# EAGLE schematic Audio_Test_Board (EAGLE 9.6.2)

## Sheet 1 of 3
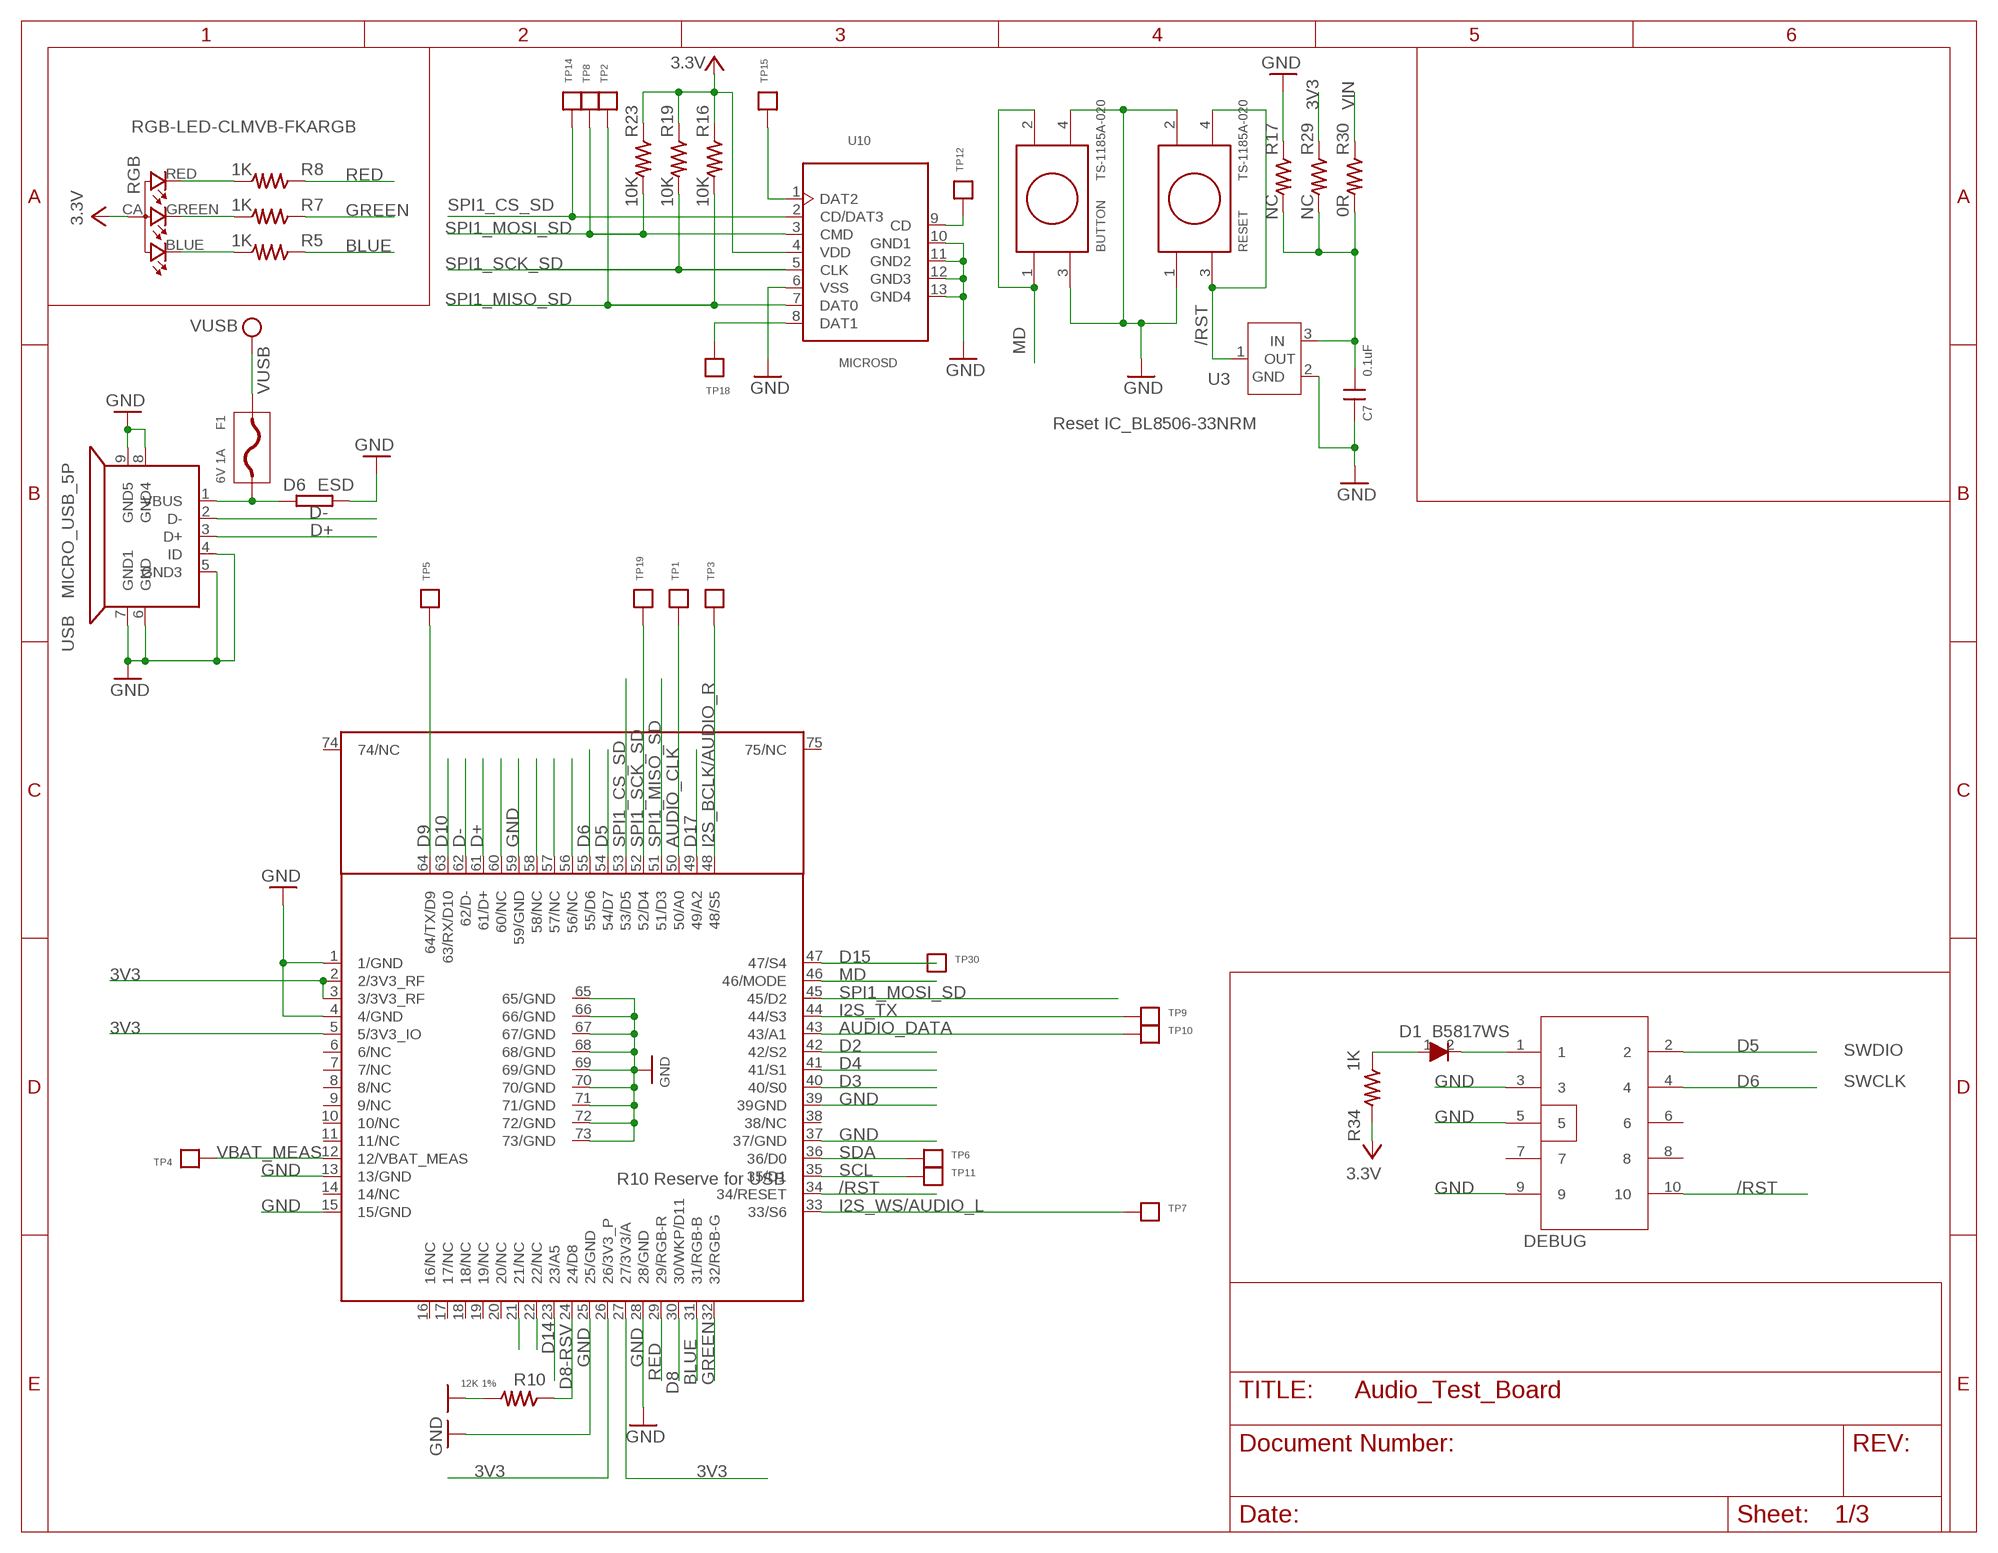
[diagram p0: schematic, sheet 1]

### Parts
BUTTON  TS-1185A-020  [TS-1185A-020]
C7  0.1uF  CAP0402  [C-0402]
D1  B5817WS  DIODESOD323  [SOD-323]
D6  ESD  RES0402S  [R-0402S]
DEBUG  CON5X2  [CON5X2_1.27]
F1  6V 1A  FUSE  [F0805]
P2  TRON  [TRON]
R5  1K  RES0402S  [R-0402S]
R7  1K  RES0402S  [R-0402S]
R8  1K  RES0402S  [R-0402S]
R10  12K 1%  RES0402S  [R-0402S]
R16  10K  RES0402S  [R-0402S]
R17  NC  RES0402S  [R-0402S]
R19  10K  RES0402S  [R-0402S]
R23  10K  RES0402S  [R-0402S]
R29  NC  RES0402S  [R-0402S]
R30  0R  RES0402S  [R-0402S]
R34  1K  RES0402S  [R-0402S]
RESET  TS-1185A-020  [TS-1185A-020]
RGB  RGB-LED-CLMVB-FKARGB  [PLCC4-2MM-RGB]
TP1  TP  [TP0.7MM]
TP2  TP  [TP0.7MM]
TP3  TP  [TP0.7MM]
TP4  TP  [TP0.7MM]
TP5  TP  [TP0.7MM]
TP6  TP  [TP0.7MM]
TP7  TP  [TP0.7MM]
TP8  TP  [TP0.7MM]
TP9  TP  [TP0.7MM]
TP10  TP  [TP0.7MM]
TP11  TP  [TP0.7MM]
TP12  TP  [TP0.7MM]
TP14  TP  [TP0.7MM]
TP15  TP  [TP0.7MM]
TP18  TP  [TP0.7MM]
TP19  TP  [TP0.7MM]
TP30  TP  [TP0.7MM]
U3  Reset IC_BL8506-33NRM  PARTICLE-SZ_BL8506  [PARTICLE-SZ_SOT-23]
U10  MICROSD  [MICROSD]
USB  MICRO_USB_5P  MICRO_USBMICRO_USB  [MICRO_USB]

### Nets
3V3 [power]: P2.2(2/3V3_RF) P2.3(3/3V3_RF) P2.5(5/3V3_IO) P2.26(26/3V3_P) P2.27(27/3V3/A) R16.1 R19.1 R23.1 R29.1 R34.2 RGB.CA U10.4(VDD) ; supply symbol labelled 3.3V ; also sheet 2,3
/RST: DEBUG.10 P2.34(34/RESET) RESET.3 RESET.4 U3.1(OUT)
AUDIO_CLK: P2.50(50/A0) TP1.P$1 ; also sheet 3
AUDIO_DATA: P2.43(43/A1) TP10.P$1 ; also sheet 3
BLUE: P2.31(31/RGB-B) R5.1
D2: P2.42(42/S2)
D3: P2.40(40/S0)
D4: P2.41(41/S1)
D5: DEBUG.2 P2.54(54/D7)
D6: DEBUG.4 P2.55(55/D6)
D8: P2.30(30/WKP/D11)
D8-RSV: P2.24(24/D8) R10.1
D9: P2.64(64/TX/D9) TP5.P$1
D10: P2.63(63/RX/D10)
D14: P2.23(23/A5)
D15: P2.47(47/S4) TP30.P$1
D17: P2.49(49/A2)
D+ [DIIFF]: P2.61(61/D+) USB.3(D+)
D- [DIIFF]: P2.62(62/D-) USB.2(D-)
GND [power]: BUTTON.3 BUTTON.4 C7.2 D6.1 DEBUG.3 DEBUG.5 DEBUG.9 P2.1(1/GND) P2.4(4/GND) P2.13(13/GND) P2.15(15/GND) P2.25(25/GND) P2.28(28/GND) P2.37(37/GND) P2.39(39GND) P2.59(59/GND) P2.65(65/GND) P2.66(66/GND) P2.67(67/GND) P2.68(68/GND) P2.69(69/GND) P2.70(70/GND) P2.71(71/GND) P2.72(72/GND) P2.73(73/GND) R10.2 R17.1 RESET.1 RESET.2 U3.2(GND) U10.6(VSS) U10.10(GND1) U10.11(GND2) U10.12(GND3) U10.13(GND4) USB.4(ID) USB.5(GND3) USB.6(GND) USB.7(GND1) USB.8(GND4) USB.9(GND5) ; also sheet 2,3
GREEN: P2.32(32/RGB-G) R7.1
I2S_BCLK/AUDIO_R: P2.48(48/S5) TP3.P$1 ; also sheet 3
I2S_TX: P2.44(44/S3) TP9.P$1 ; also sheet 3
I2S_WS/AUDIO_L: P2.33(33/S6) TP7.P$1 ; also sheet 3
MD: BUTTON.1 BUTTON.2 P2.46(46/MODE)
N$2: D1.1 R34.1
N$3: P2.21(21/NC)
N$4: P2.22(22/NC)
N$6: D1.2 DEBUG.1
N$9: TP12.P$1 U10.9(CD)
N$10: P2.56(56/NC)
N$18: D6.2 F1.P$1 USB.1(VBUS)
N$23: R8.2 RGB.RED
N$25: P2.57(57/NC)
N$26: R5.2 RGB.BLUE
N$27: R7.2 RGB.GREEN
N$33: P2.58(58/NC)
N$36: P2.60(60/NC)
N$38: TP15.P$1 U10.1(DAT2)
N$43: TP18.P$1 U10.8(DAT1)
N$49: C7.1 R17.2 R29.2 R30.2 U3.3(IN)
RED: P2.29(29/RGB-R) R8.1
SCL: P2.35(35/D1) TP11.P$1
SDA: P2.36(36/D0) TP6.P$1
SPI1_CS_SD: P2.53(53/D5) TP14.P$1 U10.2(CD/DAT3)
SPI1_MISO_SD: P2.51(51/D3) R16.2 TP2.P$1 U10.7(DAT0)
SPI1_MOSI_SD: P2.45(45/D2) R23.2 TP8.P$1 U10.3(CMD)
SPI1_SCK_SD: P2.52(52/D4) R19.2 TP19.P$1 U10.5(CLK)
VBAT_MEAS: P2.12(12/VBAT_MEAS) TP4.P$1
VIN [power]: R30.1 ; also sheet 2
VUSB [power]: F1.P$2 ; also sheet 2
Unconnected: DEBUG.6 DEBUG.7 DEBUG.8 P2.6(6/NC) P2.7(7/NC) P2.8(8/NC) P2.9(9/NC) P2.10(10/NC) P2.11(11/NC) P2.14(14/NC) P2.16(16/NC) P2.17(17/NC) P2.18(18/NC) P2.19(19/NC) P2.20(20/NC) P2.38(38/NC) P2.74(74/NC) P2.75(75/NC)

### Notes on the sheet
- SWDIO
- SWCLK
- R10 Reserve for USB

## Sheet 2 of 3
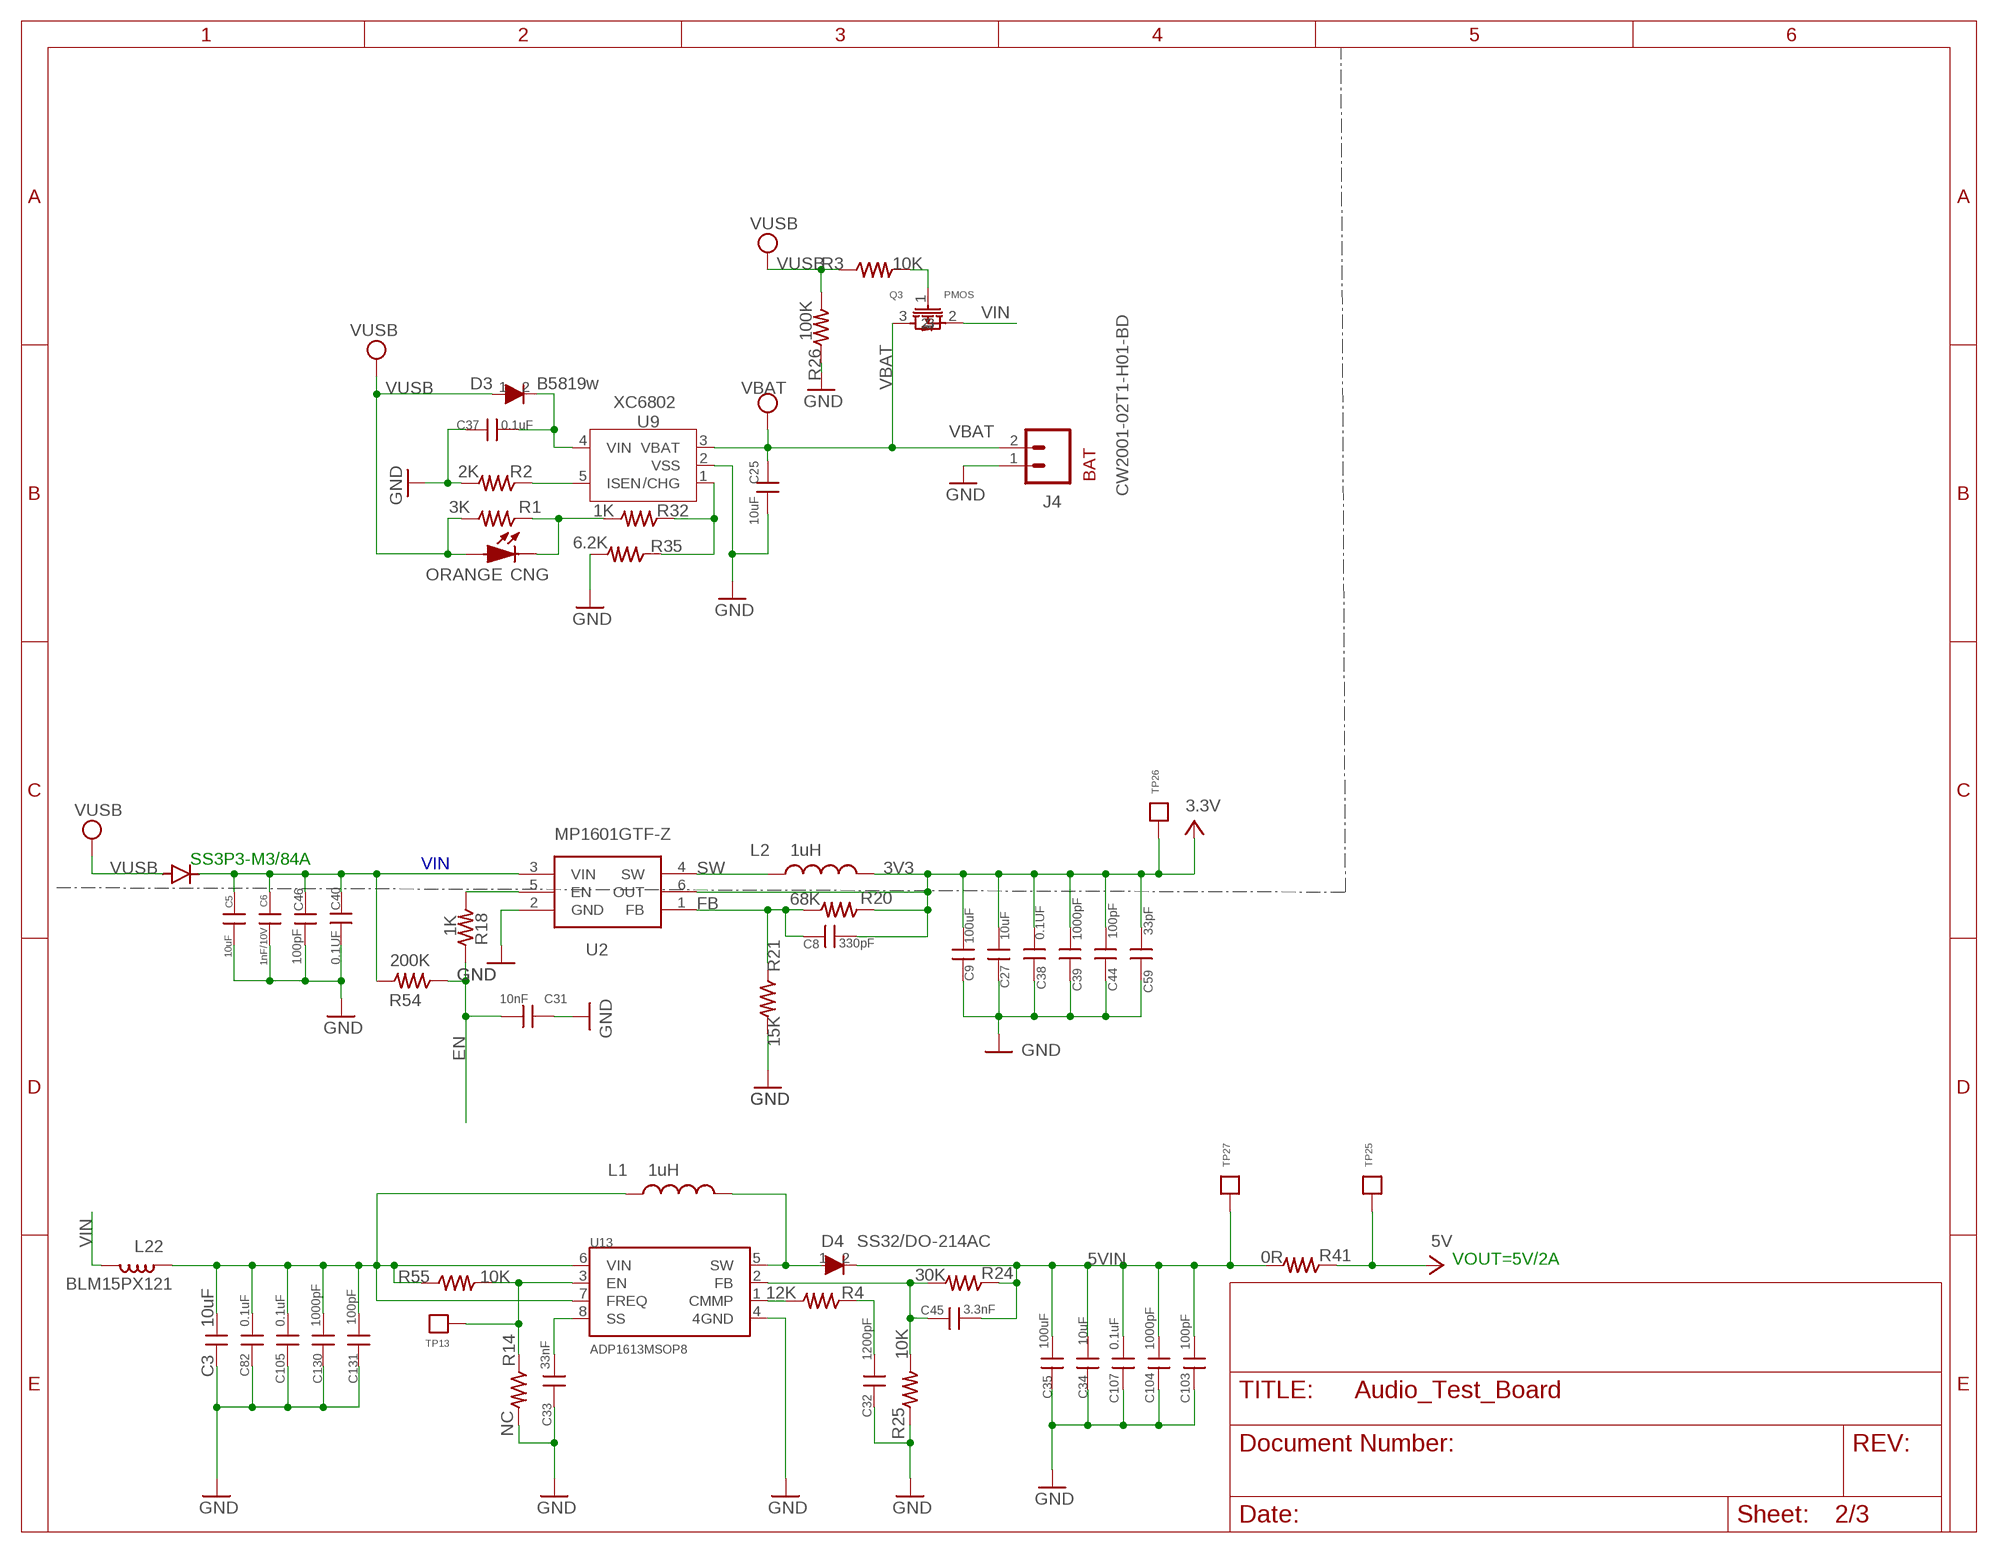
[diagram p1: schematic, sheet 2]

### Parts
C3  10uF  CAPC0603  [C0603]
C5  10uF  CAPC0603  [C0603]
C6  1nF/10V  CAP0402  [C-0402]
C8  330pF  CAP0402A  [C0402]
C9  100uF  CAPC1206  [C1206]
C25  10uF  CAPC0805  [C0805]
C27  10uF  CAPC0603  [C0603]
C31  10nF  CAP0402  [C-0402]
C32  1200pF  CAP0402  [C-0402]
C33  33nF  CAP0402  [C-0402]
C34  10uF  CAPC0603  [C0603]
C35  100uF  CAPC1206  [C1206]
C37  0.1uF  CAP0402  [C-0402]
C38  0.1UF  CAP0402  [C-0402]
C39  1000pF  CAP0402  [C-0402]
C40  0.1UF  CAP0402  [C-0402]
C44  100pF  CAP0402  [C-0402]
C45  3.3nF  CAP0402A  [C0402]
C46  100pF  CAP0402  [C-0402]
C59  33pF  CAP0402  [C-0402]
C82  0.1uF  CAP0402A  [C0402]
C103  100pF  CAP0402  [C-0402]
C104  1000pF  CAP0402  [C-0402]
C105  0.1uF  CAP0402A  [C0402]
C107  0.1uF  CAP0402  [C-0402]
C130  1000pF  CAP0402A  [C0402]
C131  100pF  CAP0402  [C-0402]
CNG  ORANGE  LED  [LED0603]
D2  SS3P3-M3/84A  DIODE_NT  [DIODE-DO-220AA_NT(SMP)]
D3  B5819w  DIODESOD123  [SOD-123]
D4  SS32/DO-214AC  SS32DO-214AC  [DO-214AC]
J4  CW2001-02T1-H01-BD  CONN_02-JST-2MM-SMT  [JST-2-SMD]
L1  1uH  INDUCTOR-SPARKFUNVLS3012ET-4R7M  [INDUCTOR-VLS-E]
L2  1uH  INDUCTOR-SPARKFUNVLS3012ET-4R7M  [INDUCTOR-VLS-E]
L22  BLM15PX121  L-2PIN  [R-0402S]
Q3  PMOS  [SOT-23]
R1  3K  RES0402S  [R-0402S]
R2  2K  RES0402S  [R-0402S]
R3  10K  RES0402S  [R-0402S]
R4  12K  RES0402S  [R-0402S]
R14  NC  RES0402S  [R-0402S]
R18  1K  RES0402S  [R-0402S]
R20  68K  RES0402S  [R-0402S]
R21  15K  RES0402S  [R-0402S]
R24  30K  RES0402S  [R-0402S]
R25  10K  RES0402S  [R-0402S]
R26  100K  RES0402S  [R-0402S]
R32  1K  RES0402S  [R-0402S]
R35  6.2K  RES0402S  [R-0402S]
R41  0R  RESR1206  [R1206]
R54  200K  RES0402S  [R-0402S]
R55  10K  RES0402S  [R-0402S]
TP13  TP  [TP0.7MM]
TP25  TP  [TP0.7MM]
TP26  TP  [TP0.7MM]
TP27  TP  [TP0.7MM]
U2  MP1601GTF-Z  [SOTFL50P160X60-6N]
U9  XC6802  [SOT-23-5]
U13  ADP1613MSOP8  [MSOP8]

### Nets
3V3 [power]: C8.2 C9.1 C27.1 C38.2 C39.2 C44.2 C59.2 L2.P$2 R20.1 TP26.P$1 U2.6(OUT) ; supply symbol labelled 3.3V ; also sheet 1,3
5V [power]: R41.1 TP25.P$1 ; also sheet 3
5VIN [power]: C34.1 C35.1 C45.2 C103.1 C104.1 C107.1 D4.2 R24.1 R41.2 TP27.P$1
CH: R32.1 R35.1 U9.1(/CHG)
EN: C31.2 R18.1 R54.1
FB: C8.1 R20.2 R21.1 U2.1(FB)
GND [power]: C3.2 C5.2 C6.2 C9.2 C25.1 C27.2 C31.1 C32.2 C33.2 C34.2 C35.2 C37.2 C38.1 C39.1 C40.1 C44.1 C46.2 C59.1 C82.2 C103.2 C104.2 C105.2 C107.2 C130.2 C131.2 J4.1 R2.2 R14.2 R21.2 R25.1 R26.1 R35.2 U2.2(GND) U9.2(VSS) U13.4(4GND) ; also sheet 1,3
N$1: R2.1 U9.5(ISEN)
N$7: C33.1 U13.8(SS)
N$8: C32.1 R4.1
N$19: R18.2 U2.5(EN)
N$20: D4.1 L1.P$2 U13.5(SW)
N$24: R14.1 R55.2 TP13.P$1 U13.3(EN)
N$28: Q3.1 R3.2
N$29: C37.1 D3.2 U9.4(VIN)
N$35: CNG.2(K) R1.1 R32.2
N$42: C45.1 R24.2 R25.2 U13.2(FB)
N$67: R4.2 U13.1(CMMP)
N$76: C3.1 C82.1 C105.1 C130.1 C131.1 L1.P$1 L22.1 R55.1 U13.6(VIN) U13.7(FREQ)
SW: L2.P$1 U2.4(SW)
VBAT: C25.2 J4.2 Q3.3 U9.3(VBAT)
VIN [power]: C5.1 C6.1 C40.2 C46.1 D2.CATHODE L22.2 Q3.2 R54.2 U2.3(VIN) ; also sheet 1
VUSB [power]: CNG.1(A) D2.ANODE D3.1 R1.2 R3.1 R26.2 ; also sheet 1

### Notes on the sheet
- BAT
- SS3P3-M3/84A
- VOUT=5V/2A

## Sheet 3 of 3
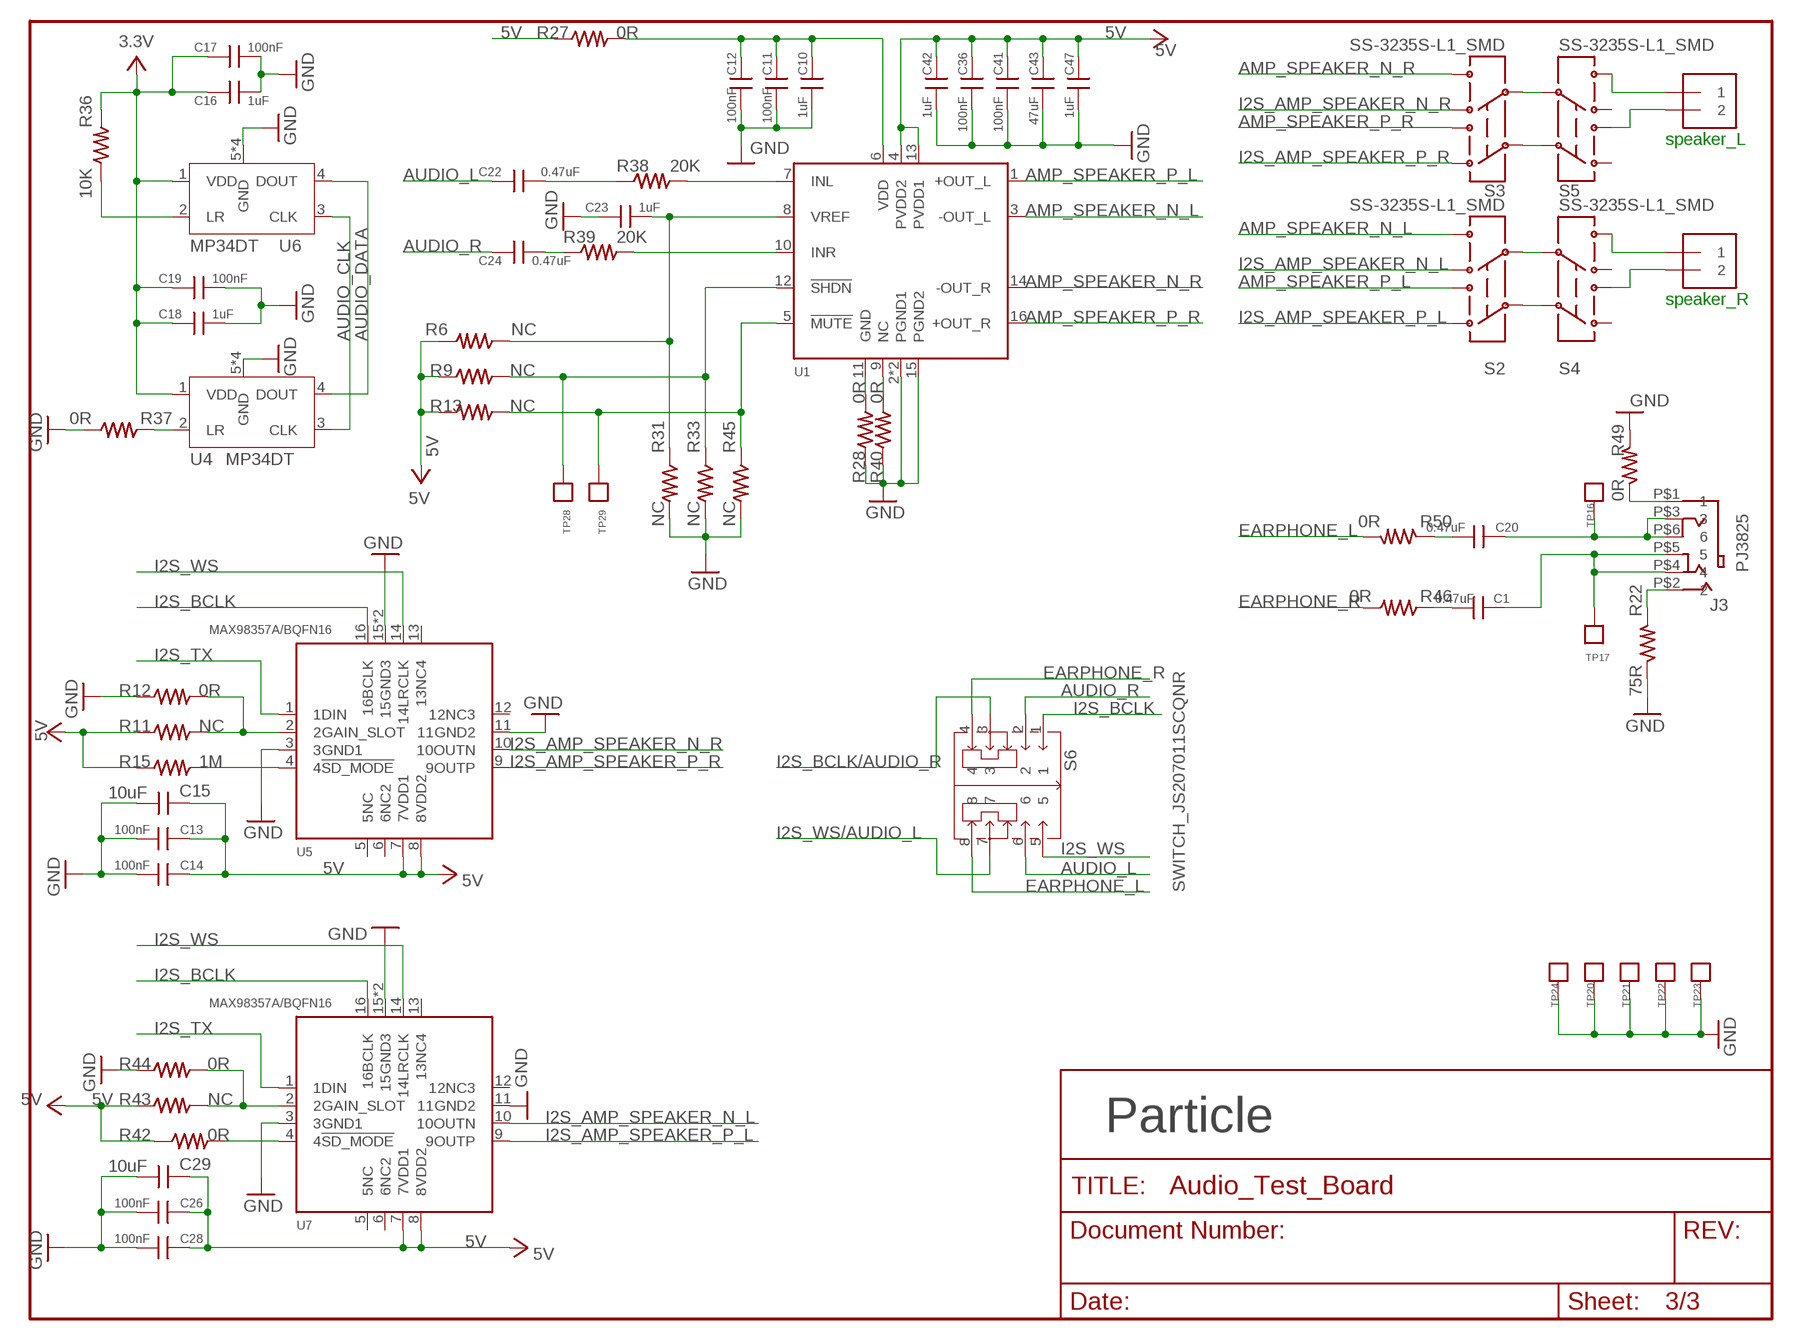
[diagram p2: schematic, sheet 3]

### Parts
C1  0.47uF  CAPC0805  [C0805]
C10  1uF  CAP0402  [C-0402]
C11  100nF  CAP0402  [C-0402]
C12  100nF  CAP0402  [C-0402]
C13  100nF  CAP0402  [C-0402]
C14  100nF  CAP0402  [C-0402]
C15  10uF  CAPC0603  [C0603]
C16  1uF  CAP0402  [C-0402]
C17  100nF  CAP0402  [C-0402]
C18  1uF  CAP0402  [C-0402]
C19  100nF  CAP0402  [C-0402]
C20  0.47uF  CAPC0805  [C0805]
C22  0.47uF  CAP0402  [C-0402]
C23  1uF  CAP0402  [C-0402]
C24  0.47uF  CAP0402  [C-0402]
C26  100nF  CAP0402  [C-0402]
C28  100nF  CAP0402  [C-0402]
C29  10uF  CAPC0603  [C0603]
C36  100nF  CAP0402  [C-0402]
C41  100nF  CAP0402  [C-0402]
C42  1uF  CAP0402  [C-0402]
C43  47uF  CAPC1206  [C1206]
C47  1uF  CAP0402  [C-0402]
J1  1X2-3.5MM  [1X2-3.5MM]
J2  1X2-3.5MM  [1X2-3.5MM]
J3  PJ3825  [PJ3825]
R6  NC  RES0402S  [R-0402S]
R9  NC  RES0402S  [R-0402S]
R11  NC  RES0402S  [R-0402S]
R12  0R  RES0402S  [R-0402S]
R13  NC  RES0402S  [R-0402S]
R15  1M  RES0402S  [R-0402S]
R22  75R  RES0402S  [R-0402S]
R27  0R  RES0402S  [R-0402S]
R28  0R  RES0402S  [R-0402S]
R31  NC  RES0402S  [R-0402S]
R33  NC  RES0402S  [R-0402S]
R36  10K  RES0402S  [R-0402S]
R37  0R  RES0402S  [R-0402S]
R38  20K  RES0402S  [R-0402S]
R39  20K  RES0402S  [R-0402S]
R40  0R  RES0402S  [R-0402S]
R42  0R  RES0402S  [R-0402S]
R43  NC  RES0402S  [R-0402S]
R44  0R  RES0402S  [R-0402S]
R45  NC  RES0402S  [R-0402S]
R46  0R  RESR0805  [R0805]
R49  0R  RESR0805  [R0805]
R50  0R  RESR0805  [R0805]
S2  SS-3235S-L1_SMD  [SS-3235S-L1_SMD]
S3  SS-3235S-L1_SMD  [SS-3235S-L1_SMD]
S4  SS-3235S-L1_SMD  [SS-3235S-L1_SMD]
S5  SS-3235S-L1_SMD  [SS-3235S-L1_SMD]
S6  SWITCH_JS207011SCQNR  [SWITCH-JS207011SCQNR]
TP16  TP  [TP0.7MM]
TP17  TP  [TP0.7MM]
TP20  TP  [TP0.7MM]
TP21  TP  [TP0.7MM]
TP22  TP  [TP0.7MM]
TP23  TP  [TP0.7MM]
TP24  TP  [TP0.7MM]
TP28  TP  [TP0.7MM]
TP29  TP  [TP0.7MM]
U1  PARTICLE-SZ_PAM8403DRSOP16  [PARTICLE-SZ_SOIC16]
U4  MP34DT  [MP34DT]
U5  MAX98357A/BQFN16  [QFN16]
U6  MP34DT  [MP34DT]
U7  MAX98357A/BQFN16  [QFN16]

### Nets
3V3 [power]: C16.2 C17.2 C18.2 C19.2 R36.2 U4.1(VDD) U6.1(VDD) ; supply symbol labelled 3.3V ; also sheet 1,2
5V [power]: C13.2 C14.2 C15.1 C26.2 C28.2 C29.1 C36.2 C41.2 C42.2 C43.2 C47.2 R6.2 R9.1 R11.1 R13.1 R15.1 R27.1 R42.1 R43.1 U1.4(PVDD2) U1.13(PVDD1) U5.7(7VDD1) U5.8(8VDD2) U7.7(7VDD1) U7.8(8VDD2) ; also sheet 2
AMP_SPEAKER_N_L: S2.4 U1.3(-OUT_L)
AMP_SPEAKER_N_R: S3.4 U1.14(-OUT_R)
AMP_SPEAKER_P_L: S2.1 U1.1(+OUT_L)
AMP_SPEAKER_P_R: S3.1 U1.16(+OUT_R)
AUDIO_CLK: U4.3(CLK) U6.3(CLK) ; also sheet 1
AUDIO_DATA: U4.4(DOUT) U6.4(DOUT) ; also sheet 1
AUDIO_L: C22.2 S6.6
AUDIO_R: C24.2 S6.2
EARPHONE_L: R50.2 S6.8
EARPHONE_R: R46.2 S6.4
GND [power]: C10.1 C11.1 C12.1 C13.1 C14.1 C15.2 C16.1 C17.1 C18.1 C19.1 C23.2 C26.1 C28.1 C29.2 C36.1 C41.1 C42.1 C43.1 C47.1 R12.1 R22.1 R28.1 R31.2 R33.2 R37.1 R40.1 R44.1 R45.2 R49.2 TP20.P$1 TP21.P$1 TP22.P$1 TP23.P$1 TP24.P$1 U1.2(PGND1) U1.15(PGND2) U1.THERM(PGND1) U4.5(GND) U4.6(GND) U4.7(GND) U4.8(GND) U5.3(3GND1) U5.11(11GND2) U5.15(15GND3) U5.TH(15GND3) U6.5(GND) U6.6(GND) U6.7(GND) U6.8(GND) U7.3(3GND1) U7.11(11GND2) U7.15(15GND3) U7.TH(15GND3) ; also sheet 1,2
I2S_AMP_SPEAKER_N_L: S2.6 U7.10(10OUTN)
I2S_AMP_SPEAKER_N_R: S3.6 U5.10(10OUTN)
I2S_AMP_SPEAKER_P_L: S2.3 U7.9(9OUTP)
I2S_AMP_SPEAKER_P_R: S3.3 U5.9(9OUTP)
I2S_BCLK: S6.1 U5.16(16BCLK) U7.16(16BCLK)
I2S_BCLK/AUDIO_R: S6.3 ; also sheet 1
I2S_TX: U5.1(1DIN) U7.1(1DIN) ; also sheet 1
I2S_WS: S6.5 U5.14(14LRCLK) U7.14(14LRCLK)
I2S_WS/AUDIO_L: S6.7 ; also sheet 1
N$5: R13.2 R45.1 TP29.P$1 U1.5(!MUTE)
N$11: R9.2 R33.1 TP28.P$1 U1.12(!SHDN)
N$12: C23.1 R6.1 R31.1 U1.8(VREF)
N$13: S3.5 S5.5
N$14: R11.2 R12.2 U5.2(2GAIN_SLOT)
N$15: J1.2 S4.1
N$16: J2.2 S5.1
N$17: R37.2 U4.2(LR)
N$21: C24.1 R39.1
N$22: S3.2 S5.2
N$30: R38.2 U1.7(INL)
N$32: J2.1 S5.4
N$34: R15.2 U5.4(4!SD_MODE)
N$39: J3.P$2 R22.2
N$40: R39.2 U1.10(INR)
N$41: C1.1 R46.1
N$44: R36.1 U6.2(LR)
N$45: R40.2 U1.9(NC)
N$46: C10.2 C11.2 C12.2 R27.2 U1.6(VDD)
N$47: R28.2 U1.11(GND)
N$51: C20.2 J3.P$3 J3.P$6 TP16.P$1
N$52: C22.1 R38.1
N$53: C1.2 J3.P$4 J3.P$5 TP17.P$1
N$59: S2.5 S4.5
N$60: S2.2 S4.2
N$61: R42.2 U7.4(4!SD_MODE)
N$62: R43.2 R44.2 U7.2(2GAIN_SLOT)
N$64: J1.1 S4.4
N$70: J3.P$1 R49.1
N$72: C20.1 R50.1
Unconnected: S4.3 S4.6 S5.3 S5.6 U5.5(5NC) U5.6(6NC2) U5.12(12NC3) U5.13(13NC4) U7.5(5NC) U7.6(6NC2) U7.12(12NC3) U7.13(13NC4)

### Notes on the sheet
- speaker_L
- speaker_R
- Particle

## Library data of the parts
BUTTON RESET = RedBear DUO:TS-1185A-020
C1 C3 C5 C6 C8-C20 C22-C24 C26-C29 C31-C36 C41-C43 C45 C47 C82 C103-C105 C107 C130 C131 = particle SZ:CAP: CAP
C7 C25 C37-C40 C44 C46 C59 = RedBear:CAP: CAP
CNG = particle SZ:LED: LED
D1 D3 = particle SZ:DIODE: DIODE
D2 = Particle:DIODE
D4 = particle SZ:SS32
D6 = RedBear:RES: RES
DEBUG = RedBear:CON5X2
F1 = RedBear:FUSE
J1 J2 = adafruit:1X2: 3.5mm Terminal block http://www.ladyada.net/library/pcb/eaglelibrary.html
J3 = particle SZ:PJ3825
J4 = SparkFun-Connectors:CONN_02: Multi connection point. Often used as Generic Header-pin footprint for 0.1 inch spaced/style header connections On any of the 0.1 inch spaced packages, you can populate with these: Break Away Headers - Straight <https://www.sparkfun.com/products/116> (PRT-00116) Break Away Male Headers - Right Angle <https://www.sparkfun.com/products/553> (PRT-00553) Female Headers <https://www.sparkfun.com/products/115> (PRT-00115) Break Away Headers - Machine Pin <https://www.sparkfun.com/products/117> (PRT-00117) Break Away Female Headers - Swiss Machine Pin <https://www.sparkfun.com/products/743> (PRT-00743) For SCREWTERMINALS and SPRING TERMINALS visit here: Screw Terimnals on SparkFun.com <https://www.sparkfun.com/search/results?term=Screw+Terminals> (5mm/3.5mm/2.54mm spacing) This device is also useful as a general connection point to wire up your design to another part of your project. Our various solder wires solder well into these plated through hole pads. Hook-Up Wire - Assortment (Stranded, 22 AWG) <https://www.sparkfun.com/products/11375> (PRT-11375) Hook-Up Wire - Assortment (Solid Core, 22 AWG) <https://www.sparkfun.com/products/11367> (PRT-11367) View the entire wire category on our website here <https://www.sparkfun.com/categories/141> Special notes: Molex polarized connector foot print use with: PRT-08233 with associated crimp pins and housings. 2.54_SCREWTERM for use with PRT-10571. 3.5mm Screw Terminal footprints for PRT-08084 5mm Screw Terminal footprints for use with PRT-08432; PROD_ID: CONN-11443
L1 L2 = Particle:INDUCTOR-SPARKFUN: Inductors Basic Inductor/Choke - 0603 and 1206. Footprints are not proven and vary greatly between part numbers. SRN6045- 33uH, 20% 1.4A
L22 = particle SZ:L-2PIN
P2 = particle SZ:TRON
Q3 = RedBear:PMOS: PMOS
R1-R4 R6 R9 R11-R15 R18 R20-R22 R24-R28 R31-R46 R49 R50 R54 R55 = particle SZ:RES: RES
R5 R7 R8 R10 R16 R17 R19 R23 R29 R30 = e402_v001:RES: RES
RGB = Particle:RGB-LED-CLMVB-FKA: CREE CLMVB-FKA RGB LED 2mm x 2mm
S2-S5 = particle SZ:SS-3235S-L1_SMD
S6 = particle SZ:SWITCH_JS207011SCQNR
TP1-TP30 = Asset Tracker SoM v1.0b:TP
U1 = AUDIO_PHOTON2_20230522-3:PARTICLE-SZ_PAM8403DR
U2 = MP1601GTF-Z:MP1601GTF-Z: Conv DC-DC Single Step Down 2.3V to 5.5V 6-Pin SOT-563 T/R - Tape and Reel Source: Datasheet <https://www.monolithicpower.com/en/documentview/productdocument/index/version/2/document_type/Datasheet/lang/en/sku/MP1601/document_id/1038/>; DESCRIPTION: Conv DC-DC Single Step Down 2.3V to 5.5V 6-Pin SOT-563 T/R - Tape and Reel; HEIGHT: 0.6mm; MANUFACTURER_NAME: Monolithic Power Systems (MPS); MANUFACTURER_PART_NUMBER: MP1601GTF-Z
U3 = Battery Current Measurement Circuit and discharge circuit-2:PARTICLE-SZ_BL8506
U4 U6 = particle SZ:MP34DT
U5 U7 = particle SZ:MAX98357A/B
U9 = particle SZ:XC6802
U10 = particle SZ:MICROSD
U13 = particle SZ:ADP1613
USB = RedBear:MICRO_USB: Micro-USB

## Net classes
0 default: width 0.152 mm, drill 0.203 mm, clearance 0.152 mm
1 power: width 0.254 mm, drill 0.203 mm, clearance 0.406 mm
2 DIIFF: width 0.242 mm, clearance 0.152 mm